# Altium schematic sheet Временные диаграмма.SchDoc
size 209 x 297 mm; PageSetup: Record=PageOptions|CenterHorizontal=True|CenterVertical=True|PrintScale=1.00|XCorrection=1.00|YCorrection=1.00|PrintKind=1|BorderSize=5000000|LeftOffset=0|BottomOffset=0|Orientation=1|PaperLength=1000|PaperWidth=1000|Scale=100|PaperSource=7|PrintQuality=-3|MediaType=1|DitherType=10|PrintScaleMode=0|PaperKind=A4|PaperIndex=9
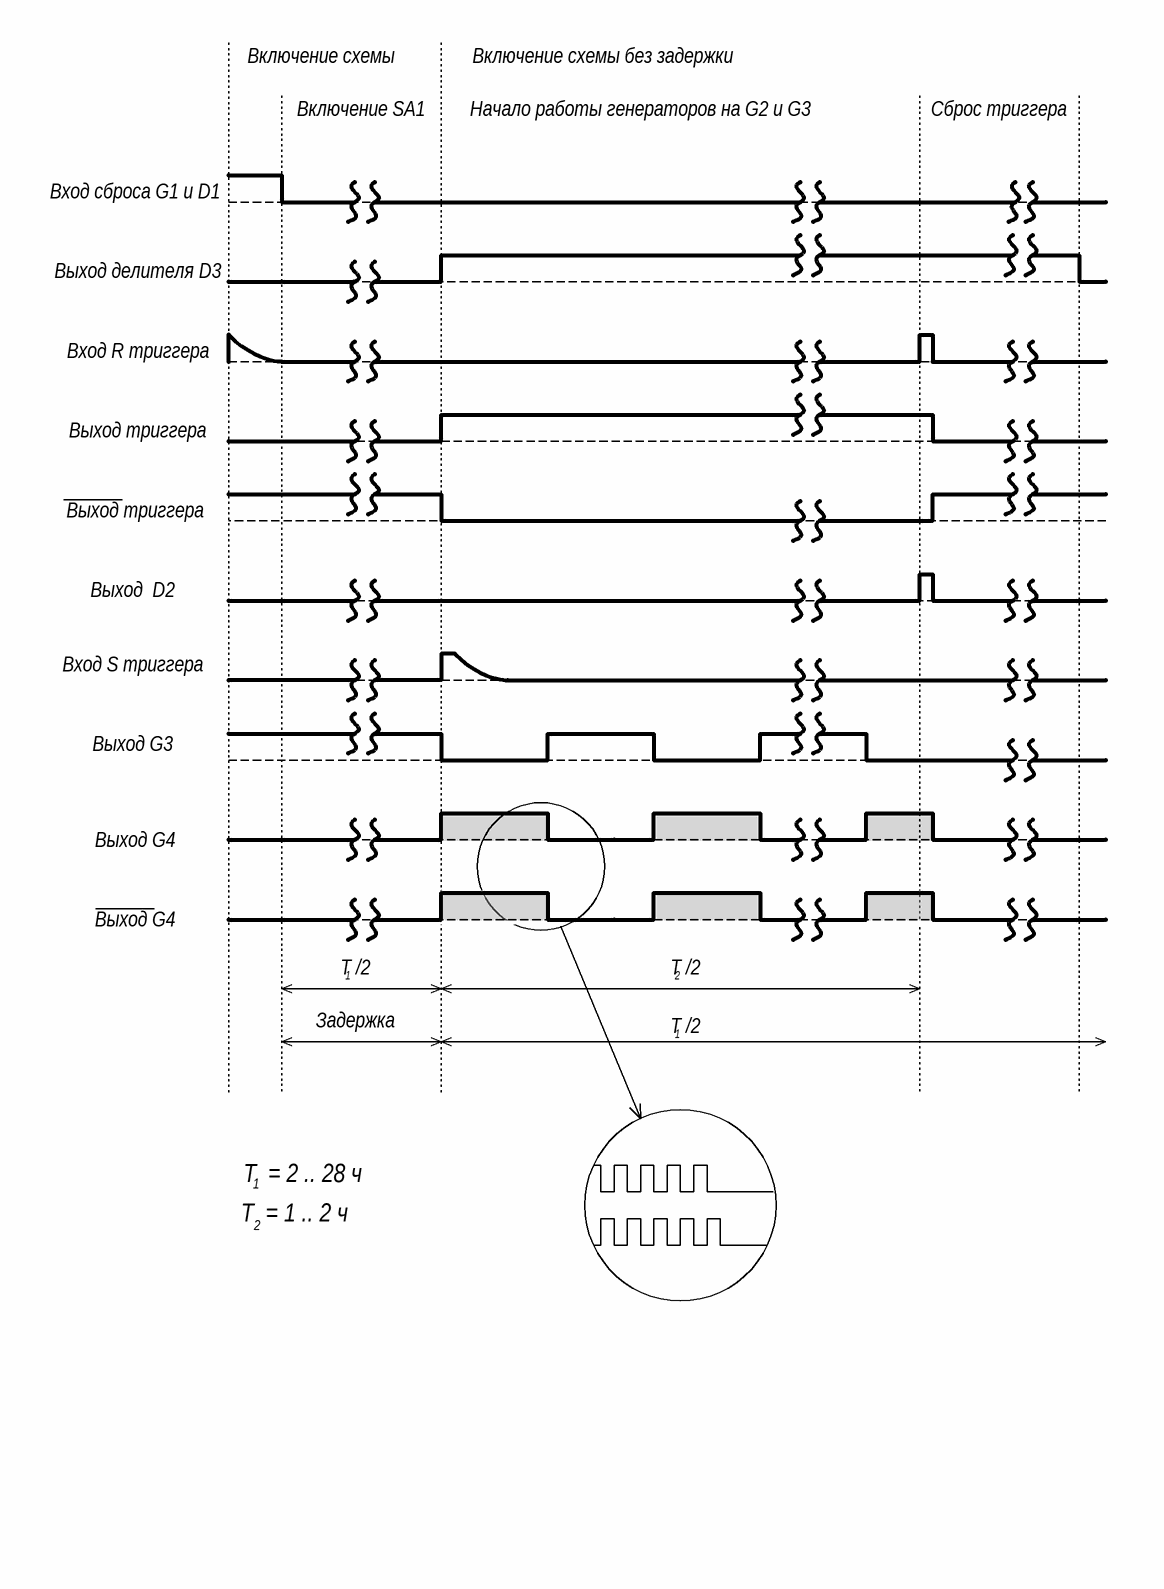
[diagram p0: Временные диаграмма.SchDoc]

## Notes on the sheet
- Включение схемы
- Включение схемы без задержки
- Включение SA1
- Начало работы генераторов на G2 и G3
- Сброс триггера
- Вход сброса G1 и D1
- Выход делителя D3
- Вход R триггера
- Выход триггера
- Выход  D2
- Вход S триггера
- Выход G3
- Выход G4
- 1
- T /2
- 2
- Задержка
- T  = 2 .. 28 ч
- T  = 1 .. 2 ч